# Altium project RoBeast_Control_Board.PrjPcb (part 4 of 4)

## Sheet RoBeast_uC.SchDoc: Microcontroller
size A; ApprovedBy: CR; DrawnBy: VM & IG; Revision: V1; SheetNumber: 7; SheetTotal: 9
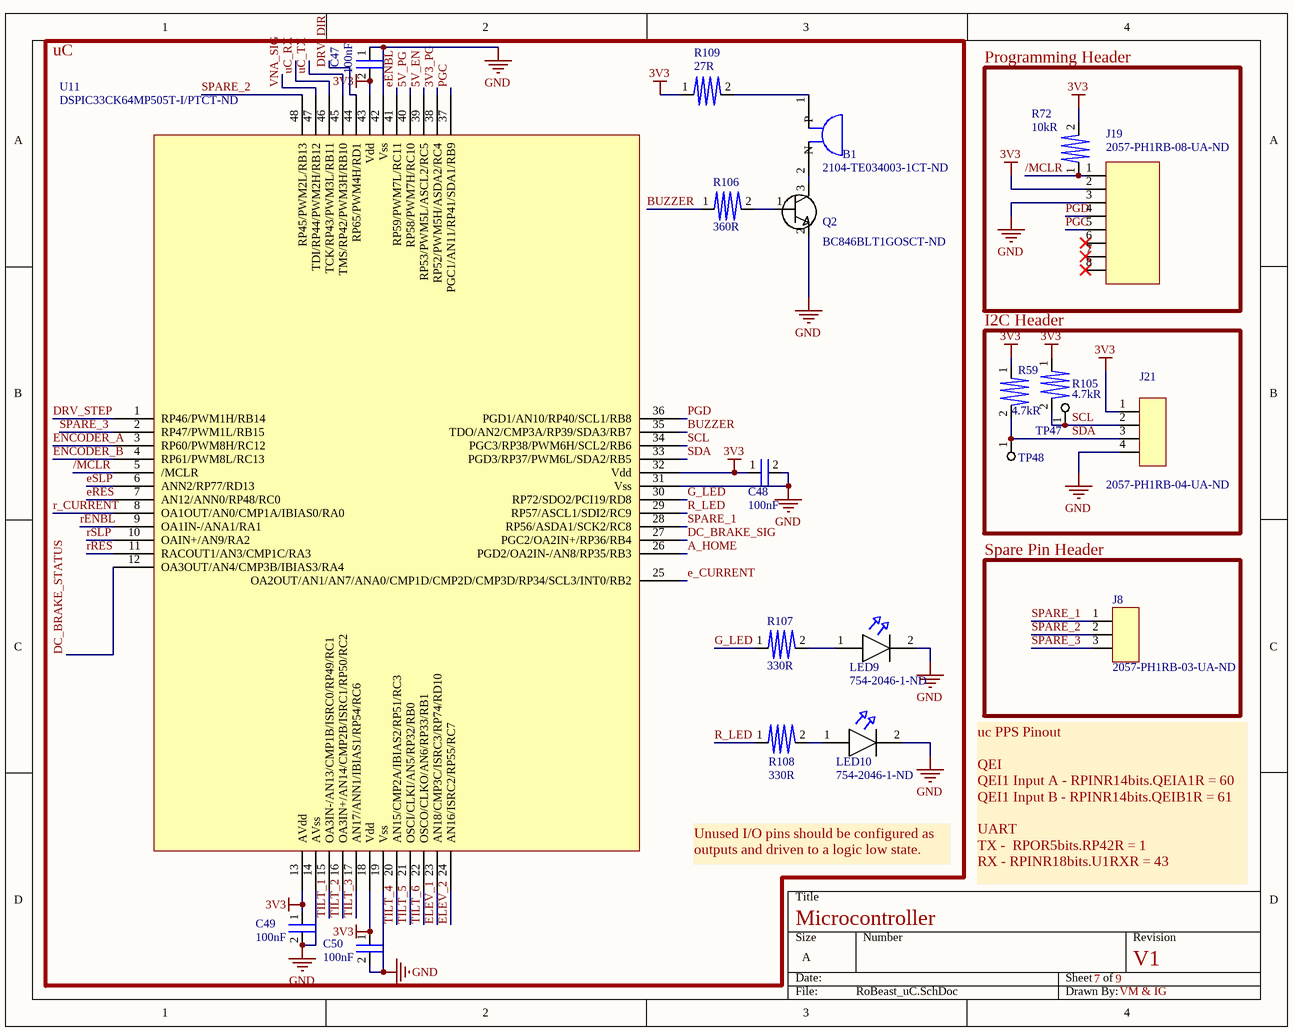
[diagram p6: RoBeast_uC.SchDoc]

### Parts
B1  Supplier Part Number 1: 2104-TE034003-1CT-ND  [TE034003-1]  (hidden comment: Buzzer)
C47  100nF  [0805]
C48  100nF  [0805]
C49  100nF  [0805]
C50  100nF  [0805]
J8  Supplier Part Number: 2057-PH1RB-03-UA-ND  [PH1RB-03-UA]  (hidden comment: 3 Pin Connector)
J19  Supplier Part Number 1: 2057-PH1RB-08-UA-ND  [PH1RB-08-UA]  (hidden comment: 8 Pin Connector)
J21  Supplier Part Number: 2057-PH1RB-04-UA-ND  [PH1RB-04-UA]  (hidden comment: 4 Pin Connector)
LED9  Supplier Part Number 1: 754-2046-1-ND  [0805_LED]  (hidden comment: Blue LED)
LED10  Supplier Part Number 1: 754-2046-1-ND  [0805_LED]  (hidden comment: Blue LED)
Q2  Supplier Part Number 1: BC846BLT1GOSCT-ND  [BC846BLT1G]  (hidden comment: NPN BJT)
R59  4.7kR  [0805]
R72  10kR  [0805]
R105  4.7kR  [0805]
R106  360R  [0805]
R107  330R  [0805]
R108  330R  [0805]
R109  27R  [0805]
TP47  Test Point  [RCWCTE]  (value not drawn)
TP48  Test Point  [RCWCTE]  (value not drawn)
U11  Supplier Part Number: DSPIC33CK64MP505T-I/PTCT-ND  [DSPIC33CK64MP505T-I/PT]  (hidden comment: uC)

### Blocks framed on the sheet
uC: B1 C47-C50 LED9 LED10 Q2 R106-R109 U11
Programming Header: J19 R72
I2C Header: J21 R59 R105 TP47 TP48
Spare Pin Header: J8

### Nets
3V3: C47.2 C48.1 C49.1 C50.1 J19.2 J21.1 R59.1 R72.2 R105.1 R109.1 U11.13(AVdd) U11.18(Vdd) U11.32(Vdd) U11.43(Vdd)
GND: C47.1 C48.2 C49.2 C50.2 J19.3 J21.4 LED9.2(K) LED10.2(K) Q2.2(E) U11.14(AVss) U11.19(Vss) U11.31(Vss) U11.42(Vss)
3V3_PG: U11.38(RP52/PWM5H/ASDA2/RC4)
5V_EN: U11.39(RP53/PWM5L/ASCL2/RC5)
5V_PG: U11.40(RP58/PWM7H/RC10)
/MCLR: J19.1 R72.1 U11.5(/MCLR)
A_HOME: U11.26(PGD2/OA2IN-/AN8/RP35/RB3)
BUZZER: R106.1 U11.35(TDO/AN2/CMP3A/RP39/SDA3/RB7)
DC_BRAKE_SIG: U11.27(PGC2/OA2IN+/RP36/RB4)
DC_BRAKE_STATUS: U11.12(OA3OUT/AN4/CMP3B/IBIAS3/RA4)
DRV_DIR: U11.44(RP65/PWM4H/RD1)
DRV_STEP: U11.1(RP46/PWM1H/RB14)
e_CURRENT: U11.25(OA2OUT/AN1/AN7/ANA0/CMP1D/CMP2D/CMP3D/RP34/SCL3/INT0/RB2)
eENBL: U11.41(RP59/PWM7L/RC11)
ELEV_1: U11.23(AN18/CMP3C/ISRC3/RP74/RD10)
ELEV_2: U11.24(AN16/ISRC2/RP55/RC7)
ENCODER_A: U11.3(RP60/PWM8H/RC12)
ENCODER_B: U11.4(RP61/PWM8L/RC13)
eRES: U11.7(AN12/ANN0/RP48/RC0)
eSLP: U11.6(ANN2/RP77/RD13)
G_LED: R107.1 U11.30(RP72/SDO2/PCI19/RD8)
PGC: J19.5 U11.37(PGC1/AN11/RP41/SDA1/RB9)
PGD: J19.4 U11.36(PGD1/AN10/RP40/SCL1/RB8)
r_CURRENT: U11.8(OA1OUT/AN0/CMP1A/IBIAS0/RA0)
R_LED: R108.1 U11.29(RP57/ASCL1/SDI2/RC9)
rENBL: U11.9(OA1IN-/ANA1/RA1)
rRES: U11.11(RACOUT1/AN3/CMP1C/RA3)
rSLP: U11.10(OAIN+/AN9/RA2)
SCL: J21.2 R105.2 TP47.1 U11.34(PGC3/RP38/PWM6H/SCL2/RB6)
SDA: J21.3 R59.2 TP48.1 U11.33(PGD3/RP37/PWM6L/SDA2/RB5)
SPARE_1: J8.1 U11.28(RP56/ASDA1/SCK2/RC8)
SPARE_2: J8.2 U11.48(RP45/PWM2L/RB13)
SPARE_3: J8.3 U11.2(RP47/PWM1L/RB15)
TILT_1: U11.15(OA3IN-/AN13/CMP1B/ISRC0/RP49/RC1)
TILT_2: U11.16(OA3IN+/AN14/CMP2B/ISRC1/RP50/RC2)
TILT_3: U11.17(AN17/ANN1/IBIAS1/RP54/RC6)
TILT_4: U11.20(AN15/CMP2A/IBIAS2/RP51/RC3)
TILT_5: U11.21(OSCI/CLKI/AN5/RP32/RB0)
TILT_6: U11.22(OSCO/CLKO/AN6/RP33/RB1)
uC_RX: U11.46(TCK/RP43/PWM3L/RB11)
uC_TX: U11.45(TMS/RP42/PWM3H/RB10)
VNA_SIG: U11.47(TDI/RP44/PWM2H/RB12)
NetB1_1: B1.1(P) R109.2
NetB1_2: B1.2(N) Q2.3(C)
NetLED9_1: LED9.1(A) R107.2
NetLED10_1: LED10.1(A) R108.2
NetQ2_1: Q2.1(B) R106.2

Not connected (* = marked no-connect by the designer): J19 6* 7* 8*

### Notes on the sheet
- Unused I/O pins should be configured as outputs and driven to a logic low state.
- uc PPS Pinout
  QEI
  QEI1 Input A - RPINR14bits.QEIA1R = 60
  QEI1 Input B - RPINR14bits.QEIB1R = 61
  UART
  TX -  RPOR5bits.RP42R = 1
  RX - RPINR18bits.U1RXR = 43

### Library data of the parts
B1 = TE034003-1: Electro-mechanical Transducer; Manufacturer: DB Unlimited; Supplier 1: Digikey; Manufacturer Part Number: TE034003-1; RoHS: No; Category: Audio Products; Stock 1: 5468; Pricing 1: 1=2.3, 10=1.911, 25=1.7652, 50=1.659, 100=1.5568, 250=1.44984, 500=1.33496, 1000=1.29987 (USD)
C47-C50 = C0805C104J5RAC7800: Ceramic Capacitor, Multilayer, Ceramic, 50V, 5% +Tol, 5% -Tol, X7R, 15% TC, 0.1uF, Surface Mount, 0805; Manufacturer: KEMET; Manufacturer Part Number: C0805C104J5RACTU; Multilayer: Yes; Supplier 1: Digikey; RoHS: Yes; Category: Ceramic Capacitors; Stock 1: 605061; Pricing 1: 1=0.18, 10=0.122, 50=0.0732, 100=0.0576, 500=0.04252, 1000=0.03519 (USD); Mount: Surface Mount; Number of Pins: 2; Dielectric Material: Ceramic; Package Shape: Rectangular; Size Code: 0805; Terminal Finish: Nickel; Min Operating Temperature: -55°C; Max Operating Temperature: 125°C; JESD-609 Code: e3; Capacitor Type: Ceramic; Negative Tolerance: 5%; Packaging: Tape and Reel; Positive Tolerance: 5%; Rated DC Voltage (URdc): 50V; Temperature Characteristics Code: X7R; Termination: Wraparound; Reach SVHC Compliant: Yes; RoHS Compliant: Yes; ComponentLink1URL: http://capacitoredge.kemet.com:80/capedge2/intellispec.jsp?pn=C0805C104J5RACTU&displayPN=C0805C104J5RACTU&src-supplier=IHS+Markit; ComponentLink1Description: http://capacitoredge.kemet.com:80/capedge2/intellispec.jsp?pn=C0805C104J5RACTU&displayPN=C0805C104J5RACTU&src-supplier=IHS+Markit; ComponentLink2URL: https://datasheet.ciiva.com/7842/1732721-7842179.pdf?src-supplier=Element14; ComponentLink2Description: https://datasheet.ciiva.com/7842/1732721-7842179.pdf?src-supplier=Element14; ComponentLink3URL: https://datasheet.ciiva.com/28682/1851736-28682223.pdf?src-supplier=Element14; ComponentLink3Description: https://datasheet.ciiva.com/28682/1851736-28682223.pdf?src-supplier=Element14; ComponentLink4URL: https://datasheet.ciiva.com/7258/1828800-7258413.pdf?src-supplier=Newark; ComponentLink4Description: https://datasheet.ciiva.com/7258/1828800-7258413.pdf?src-supplier=Newark; ComponentLink5URL: https://datasheet.ciiva.com/14589/70095383-14589015.pdf?src-supplier=Allied+Electronics; ComponentLink5Description: https://datasheet.ciiva.com/14589/70095383-14589015.pdf?src-supplier=Allied+Electronics; ComponentLink6URL: https://datasheet.ciiva.com/5417/kem-c1002-x7r-smd-5417352.pdf?src-supplier=Mouser; ComponentLink6Description: https://datasheet.ciiva.com/5417/kem-c1002-x7r-smd-5417352.pdf?src-supplier=Mouser; ComponentLink7URL: https://datasheet.ciiva.com/39122/docfinderpartnumberc0402c102k5ractu-39122924.pdf?src-supplier=Onlinecomponents.com; ComponentLink7Description: https://datasheet.ciiva.com/39122/docfinderpartnumberc0402c102k5ractu-39122924.pdf?src-supplier=Onlinecomponents.com; Supplier Part Number 1: 399-C0805C104J5RAC7800CT-ND; Capacitance: 100nF
J8 = PH1RB-03-UA: Conn Unshrouded Header HDR 3 POS 2.54mm Solder RA Side Entry Thru-Hole; Manufacturer: Adam Equipment; Supplier: Digikey; Manufacturer Part Number: PH1RB-03-UA; RoHS: No; Category: Connectors; Stock: 27919; Pricing: 1=0.12, 10=0.097, 100=0.0718, 500=0.05938, 1000=0.05196, 5000=0.04454, 10000=0.0433 (USD); ComponentLink1URL: http://www.adam-tech.com/downloader.php?p=PH1RB-XX-UA.pdf&src-supplier=Digikey; ComponentLink1Description: http://www.adam-tech.com/downloader.php?p=PH1RB-XX-UA.pdf&src-supplier=Digikey
J19 = PH1RB-08-UA: Conn Unshrouded Header HDR 8 POS 2.54mm Solder RA Thru-Hole; Manufacturer: Adam Equipment; Supplier 1: Digikey; Manufacturer Part Number: PH1RB-08-UA; RoHS: No; Category: Connectors; Stock 1: 10117; Pricing 1: 1=0.23, 10=0.196, 100=0.1505, 500=0.12738, 1000=0.10423, 5000=0.09265, 10000=0.08396 (USD)
J21 = PH1RB-04-UA: Conn Unshrouded Header HDR 4 POS 2.54mm Solder RA Thru-Hole; Manufacturer: Adam Equipment; Supplier: Digikey; Manufacturer Part Number: PH1RB-04-UA; RoHS: No; Category: Connectors; Stock: 13315; Pricing: 1=0.12, 10=0.094, 100=0.0697, 500=0.0577, 1000=0.05048, 5000=0.04327, 10000=0.04207 (USD); ComponentLink1URL: http://www.adam-tech.com/downloader.php?p=PH1RB-XX-UA.pdf&src-supplier=Digikey; ComponentLink1Description: http://www.adam-tech.com/downloader.php?p=PH1RB-XX-UA.pdf&src-supplier=Digikey
LED9 LED10 = APTD2012LQBC/D: Single Color LED; Manufacturer: Kingbright; Supplier 1: Digikey; Manufacturer Part Number: APTD2012LQBC/D; RoHS: Yes; Category: LEDs; Stock 1: 20866; Pricing 1: 1=0.54, 10=0.358, 100=0.2367, 1000=0.18275 (USD); RoHS Compliant: Yes; ComponentLink1URL: https://datasheet.ciiva.com:443/pdfs/VipMasterIC/IC/KBEC/KBEC-S-A0008946974/KBEC-S-A0008947044-1.pdf?src-supplier=IHS+Markit; ComponentLink1Description: https://datasheet.ciiva.com:443/pdfs/VipMasterIC/IC/KBEC/KBEC-S-A0008946974/KBEC-S-A0008947044-1.pdf?src-supplier=IHS+Markit; ComponentLink2URL: http://www.kingbrightusa.com/images/catalog/SPEC/APTD2012LQBC-D.pdf?src-supplier=Digikey; ComponentLink2Description: http://www.kingbrightusa.com/images/catalog/SPEC/APTD2012LQBC-D.pdf?src-supplier=Digikey
Q2 = BC846BLT1G: Small Signal Bipolar Transistor, 0.1A I(C), 65V V(BR)CEO, 1-Element, NPN, Silicon, TO-236; Manufacturer: ON Semiconductor; Package Body Material: Plastic; Power Dissipation-Max (Abs): 225mW; Max Collector Current: 100mA; DC Current Gain-Min (hFE): 200; Number of Elements: 1; Transition Frequency-Nom (fT): 100MHz; Transistor Application: SWITCHING; Time @ Peak Reflow Temperature-Max (s): 40s; Qualification Status: Not Qualified; Supplier 1: Digikey; Manufacturer Part Number: BC846BLT1G; RoHS: Yes; Category: BJTs; Stock 1: 1618453; Pricing 1: 1=0.14, 10=0.097, 100=0.0522, 500=0.04102, 1000=0.02848 (USD); Number of Pins: 3; Terminal Finish: Tin; Package Shape: Rectangular; Transistor Element Material: SILICON; Max Operating Temperature: 150°C; JESD-609 Code: e3; Polarity/Channel Type: NPN; Moisture Sensitivity Level: 1; Package Style: SMALL OUTLINEMeter; Surface Mount: Yes; Terminal Form: Gull Wing; Terminal Position: DUAL; Collector-emitter Voltage-Max: 65V; JESD-30 Code: R-PDSO-G3; Peak Reflow Temperature (Cel): 260°C; Reach SVHC Compliant: Yes; RoHS Compliant: Yes; JEDEC-95 Code: TO-236; ComponentLink1URL: https://datasheet.ciiva.com:443/pdfs/VipMasterIC/IC/ONSM/ONSM-S-A0009451914/ONSM-S-A0009451914-1.pdf?src-supplier=IHS+Markit; ComponentLink1Description: https://datasheet.ciiva.com:443/pdfs/VipMasterIC/IC/ONSM/ONSM-S-A0009451914/ONSM-S-A0009451914-1.pdf?src-supplier=IHS+Markit; ComponentLink2URL: https://datasheet.ciiva.com/15138/getdatasheetpartid-38790-15138644.pdf?src-supplier=Verical; ComponentLink2Description: https://datasheet.ciiva.com/15138/getdatasheetpartid-38790-15138644.pdf?src-supplier=Verical; ComponentLink3URL: https://datasheet.ciiva.com/27056/2010421-27056146.pdf?src-supplier=Jameco; ComponentLink3Description: https://datasheet.ciiva.com/27056/2010421-27056146.pdf?src-supplier=Jameco; ComponentLink4URL: https://datasheet.ciiva.com/7972/bc846alt1-d-7972189.pdf?src-supplier=Element14; ComponentLink4Description: https://datasheet.ciiva.com/7972/bc846alt1-d-7972189.pdf?src-supplier=Element14
R59 R105 = RCC08054K70FKEA: Fixed Resistor, Metal Glaze/thick Film, 0.25W, 4700ohm, 200V, 1% +/-Tol, 100ppm/Cel, Surface Mount, 0805; Manufacturer: Vishay Dale; Supplier 1: Digikey; Manufacturer Part Number: RCC08054K70FKEA; RoHS: Yes; Category: Chip SMD Resistors; Stock 1: 96612; Pricing 1: 1=0.15, 10=0.069, 50=0.0454, 100=0.0385, 500=0.0271, 1000=0.0236 (USD); Supplier Part Number 1: 541-RCC08054K70FKEACT-ND
R72 = RMCF0805FT10K0: Fixed Resistor, Metal Glaze/thick Film, 0.125W, 10000ohm, 150V, 1% +/-Tol, 100ppm/Cel, Surface Mount, 0805; Manufacturer: Stackpole Electronics; Rated Power Dissipation (P): 125mW; Rated Temperature: 70°C; Temperature Coefficient: 100ppm/°C; Package Height: 0.5mm; Package Length: 2mm; Package Width: 1.25mm; Reference Standard: AEC-Q200; Supplier 1: Digikey; Manufacturer Part Number: RMCF0805FT10K0; RoHS: Yes; Category: Chip SMD Resistors; Stock 1: 3602197; Pricing 1: 1=0.1, 10=0.02, 50=0.0124, 100=0.0103, 500=0.007, 1000=0.00601 (USD); Mount: Surface Mount; Number of Pins: 2; Package Shape: Rectangular; Size Code: 0805; Terminal Finish: Nickel; Min Operating Temperature: -55°C; Max Operating Temperature: 155°C; Tolerance: 1%; JESD-609 Code: e3; Resistor Type: FIXED RESISTOR; Construction: Rectangular; Package Style: SMTMeter; Packaging: Tape and Reel; Resistance: 10kR; Technology: METAL GLAZE/THICK FILM; Termination: Wraparound; Working Voltage: 150V; Reach SVHC Compliant: Yes; RoHS Compliant: Yes; ComponentLink1URL: https://datasheet.ciiva.com:443/pdfs/VipMasterIC/IC/SEIE/SEIE-S-A0009541969/SEIE-S-A0009541969-1.pdf?src-supplier=IHS+Markit; ComponentLink1Description: https://datasheet.ciiva.com:443/pdfs/VipMasterIC/IC/SEIE/SEIE-S-A0009541969/SEIE-S-A0009541969-1.pdf?src-supplier=IHS+Markit; ComponentLink2URL: https://datasheet.ciiva.com/15193/getdatasheetpartid-362046-15193525.pdf?src-supplier=Verical; ComponentLink2Description: https://datasheet.ciiva.com/15193/getdatasheetpartid-362046-15193525.pdf?src-supplier=Verical; Supplier Part Number 1: RMCF0805FT10K0CT-ND
R106 = RC0805FR-07360RL: Fixed Resistor, Metal Glaze/thick Film, 0.125W, 360ohm, 150V, 1% +/-Tol, 100ppm/Cel, Surface Mount, 0805; Manufacturer: Yageo; Additional Feature: LASER TRIMMABLE; Rated Power Dissipation (P): 125mW; Rated Temperature: 70°C; Temperature Coefficient: 100ppm/°C; Package Height: 0.5mm; Package Length: 2mm; Package Width: 1.25mm; Supplier 1: Digikey; Manufacturer Part Number: RC0805FR-07360RL; RoHS: Yes; Category: Chip SMD Resistors; Stock 1: 62488; Pricing 1: 1=0.1, 10=0.026, 50=0.0162, 100=0.0136, 500=0.00938, 1000=0.0081 (USD); Mount: Surface Mount; Number of Pins: 2; Package Shape: Rectangular; Size Code: 0805; Terminal Finish: Nickel; Min Operating Temperature: -55°C; Max Operating Temperature: 155°C; Tolerance: 1%; JESD-609 Code: e3; Resistor Type: FIXED RESISTOR; Construction: Chip; Package Style: SMTMeter; Packaging: Tape and Reel; Resistance: 360R; Technology: METAL GLAZE/THICK FILM; Termination: Wraparound; Working Voltage: 150V; Reach SVHC Compliant: Yes; RoHS Compliant: Yes; ComponentLink1URL: https://datasheet.ciiva.com:443/pdfs/VipMasterIC/IC/YAGO/YAGO-S-A0008145938/YAGO-S-A0008145938-1.pdf?src-supplier=IHS+Markit; ComponentLink1Description: https://datasheet.ciiva.com:443/pdfs/VipMasterIC/IC/YAGO/YAGO-S-A0008145938/YAGO-S-A0008145938-1.pdf?src-supplier=IHS+Markit; ComponentLink2URL: https://datasheet.ciiva.com/11808/0900766b8106beab-11808261.pdf?src-supplier=Rs; ComponentLink2Description: https://datasheet.ciiva.com/11808/0900766b8106beab-11808261.pdf?src-supplier=Rs; ComponentLink3URL: https://datasheet.ciiva.com/17423/rc0805-17423149.pdf?src-supplier=Future+Electronics; ComponentLink3Description: https://datasheet.ciiva.com/17423/rc0805-17423149.pdf?src-supplier=Future+Electronics; ComponentLink4URL: https://datasheet.ciiva.com/12667/rc0805-12667401.pdf?src-supplier=Mouser; ComponentLink4Description: https://datasheet.ciiva.com/12667/rc0805-12667401.pdf?src-supplier=Mouser; Supplier Part Number 1: 311-360CRCT-ND
R107 R108 = RC0805FR-13330RL: Fixed Resistor, Metal Glaze/thick Film, 0.125W, 330ohm, 150V, 1% +/-Tol, 100ppm/Cel, Surface Mount, 0805; Manufacturer: Yageo; Additional Feature: LASER TRIMMABLE; Rated Power Dissipation (P): 125mW; Rated Temperature: 70°C; Temperature Coefficient: 100ppm/°C; Package Height: 0.5mm; Package Length: 2mm; Package Width: 1.25mm; Supplier 1: Digikey; Manufacturer Part Number: RC0805FR-13330RL; RoHS: Yes; Category: Chip SMD Resistors; Stock 1: 36292; Pricing 1: 1=0.1, 10=0.025, 50=0.016, 100=0.0133, 500=0.00912, 1000=0.00787, 5000=0.00577, 10000=0.00511 (USD); Mount: Surface Mount; Number of Pins: 2; Package Shape: Rectangular; Size Code: 0805; Terminal Finish: Nickel; Min Operating Temperature: -55°C; Max Operating Temperature: 155°C; Tolerance: 1%; JESD-609 Code: e3; Resistor Type: FIXED RESISTOR; Construction: Chip; Package Style: SMTMeter; Packaging: Tape and Reel; Resistance: 330R; Technology: METAL GLAZE/THICK FILM; Termination: Wraparound; Working Voltage: 150V; Reach SVHC Compliant: Yes; RoHS Compliant: Yes; ComponentLink1URL: https://datasheet.ciiva.com:443/pdfs/VipMasterIC/IC/YAGO/YAGO-S-A0008145938/YAGO-S-A0008145938-1.pdf?src-supplier=IHS+Markit; ComponentLink1Description: https://datasheet.ciiva.com:443/pdfs/VipMasterIC/IC/YAGO/YAGO-S-A0008145938/YAGO-S-A0008145938-1.pdf?src-supplier=IHS+Markit; ComponentLink2URL: https://datasheet.ciiva.com/12575/rc0805-257173-12575525.pdf?src-supplier=Mouser; ComponentLink2Description: https://datasheet.ciiva.com/12575/rc0805-257173-12575525.pdf?src-supplier=Mouser; Supplier Part Number 1: 13-RC0805FR-13330RLCT-ND
R109 = SG73P2ATTD27R0F: Fixed Resistor, Metal Glaze/thick Film, 0.5W, 27ohm, 400V, 1% +/-Tol, 200ppm/Cel, Surface Mount, 0805; Manufacturer: KOA Speer; Rated Power Dissipation (P): 250mW; Rated Temperature: 70°C; Temperature Coefficient: 200ppm/°C; Package Height: 0.5mm; Package Length: 2mm; Package Width: 1.25mm; Reference Standard: AEC-Q200; Supplier 1: Digikey; Manufacturer Part Number: SG73P2ATTD27R0F; RoHS: Yes; Category: Chip SMD Resistors; Stock 1: 9351; Pricing 1: 1=0.18, 10=0.09, 50=0.0602, 100=0.0514, 500=0.03686, 1000=0.03245 (USD); Mount: Surface Mount; Number of Pins: 2; Size Code: 0805; Terminal Finish: Nickel; Min Operating Temperature: -55°C; Max Operating Temperature: 155°C; Tolerance: 1%; JESD-609 Code: e3; Resistor Type: FIXED RESISTOR; Construction: Rectangular; Package Style: SMTMeter; Packaging: Tape and Reel; Resistance: 27R; Technology: METAL GLAZE/THICK FILM; Termination: Wraparound; Working Voltage: 400V; Reach SVHC Compliant: Yes; RoHS Compliant: Yes; ComponentLink1URL: https://datasheet.ciiva.com:443/pdfs/VipMasterIC/IC/KOAS/KOAS-S-A0009586268/KOAS-S-A0009586268-1.pdf?src-supplier=IHS+Markit; ComponentLink1Description: https://datasheet.ciiva.com:443/pdfs/VipMasterIC/IC/KOAS/KOAS-S-A0009586268/KOAS-S-A0009586268-1.pdf?src-supplier=IHS+Markit; ComponentLink2URL: http://www.koaspeer.com/catimages/Products/SG73/SG73.pdf?src-supplier=Mouser; ComponentLink2Description: http://www.koaspeer.com/catimages/Products/SG73/SG73.pdf?src-supplier=Mouser; Supplier Part Number 1: 2019-SG73P2ATTD27R0FCT-ND
TP47 TP48 = RCWCTE: Testing/Accessories; Manufacturer: KOA Speer; Rated Temperature: 70°C; Resistance: 0R; Package Height: 2mm; Package Length: 3.2mm; Package Width: 1.6mm; Reference Standard: AEC-Q200; Supplier 1: Digikey; Manufacturer Part Number: RCWCTE; RoHS: Yes; Category: Chip SMD Resistors; Stock 1: 132357; Pricing 1: 1=0.16, 10=0.137, 25=0.1212, 50=0.1132, 100=0.105, 250=0.09292, 500=0.08888, 1000=0.07272 (USD); Mount: Surface Mount; Number of Pins: 2; Package Shape: Rectangular; Size Code: 1206; Terminal Finish: Copper; Min Operating Temperature: -55°C; Max Operating Temperature: 125°C; JESD-609 Code: e2; Resistor Type: FIXED RESISTOR; Construction: Chip; Package Style: SMTMeter; Packaging: Tape and Reel; Termination: Wraparound; Reach SVHC Compliant: Yes; RoHS Compliant: Yes; ComponentLink1URL: https://datasheet.ciiva.com:443/pdfs/VipMasterIC/IC/KOAS/KOASS03065/KOASS03065-1.pdf?src-supplier=IHS+Markit; ComponentLink1Description: https://datasheet.ciiva.com:443/pdfs/VipMasterIC/IC/KOAS/KOASS03065/KOASS03065-1.pdf?src-supplier=IHS+Markit; ComponentLink2URL: https://datasheet.ciiva.com/34302/1876186-34302940.pdf?src-supplier=Jameco; ComponentLink2Description: https://datasheet.ciiva.com/34302/1876186-34302940.pdf?src-supplier=Jameco; ComponentLink3URL: https://datasheet.ciiva.com/5556/rc-5556236.pdf?src-supplier=Mouser; ComponentLink3Description: https://datasheet.ciiva.com/5556/rc-5556236.pdf?src-supplier=Mouser; ComponentLink4URL: https://datasheet.ciiva.com/26821/getdatasheetpartid-110197-26821157.pdf?src-supplier=Verical; ComponentLink4Description: https://datasheet.ciiva.com/26821/getdatasheetpartid-110197-26821157.pdf?src-supplier=Verical; Supplier Part Number 1: 2019-RCWCTECT-ND
U11 = DSPIC33CK64MP505T-I/PT: 16-Bit Size, 0-Ext Bit, 64MHz, CMOS, PQFP48; Manufacturer: Microchip; Supplier: Digikey; Manufacturer Part Number: DSPIC33CK64MP505T-I/PT; RoHS: No; Category: Microcontrollers; Stock: 1600; Pricing: 1=3.75, 25=3.44, 100=3.12 (USD); ComponentLink1URL: https://datasheet.ciiva.com:443/pdfs/VipMasterIC/IC/MCHP/MCHP-S-A0007771634/MCHP-S-A0007771634-1.pdf?src-supplier=IHS+Markit; ComponentLink1Description: https://datasheet.ciiva.com:443/pdfs/VipMasterIC/IC/MCHP/MCHP-S-A0007771634/MCHP-S-A0007771634-1.pdf?src-supplier=IHS+Markit; ComponentLink2URL: http://www.microchip.com/mymicrochip/filehandler.aspx?ddocname=en606233&src-supplier=Digikey; ComponentLink2Description: http://www.microchip.com/mymicrochip/filehandler.aspx?ddocname=en606233&src-supplier=Digikey

## Sheet RoBeast_Current_Sense.SchDoc: Current Sense
size A4; ApprovedBy: CR; DrawnBy: VM & IG; Revision: V1; SheetNumber: 8; SheetTotal: 9
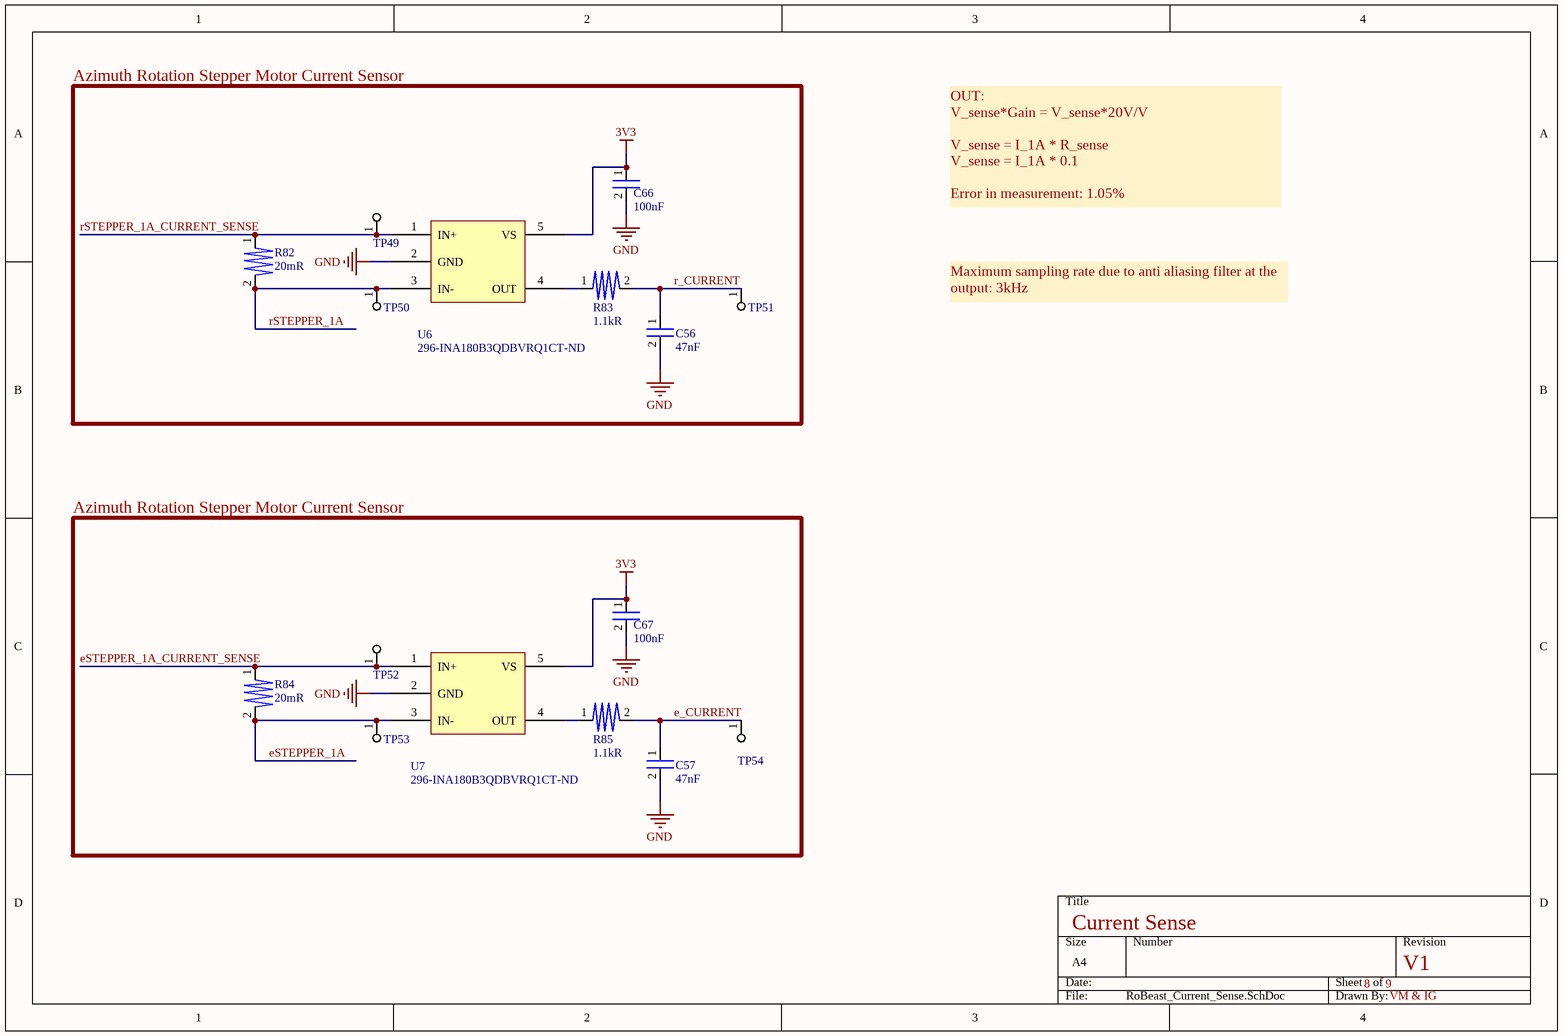
[diagram p7: RoBeast_Current_Sense.SchDoc]

### Parts
C56  47nF  [0805]
C57  47nF  [0805]
C66  100nF  [0805]
C67  100nF  [0805]
R82  20mR  [0805]
R83  1.1kR  [0805]
R84  20mR  [0805]
R85  1.1kR  [0805]
TP49  Test Point  [RCWCTE]  (value not drawn)
TP50  Test Point  [RCWCTE]  (value not drawn)
TP51  Test Point  [RCWCTE]  (value not drawn)
TP52  Test Point  [RCWCTE]  (value not drawn)
TP53  Test Point  [RCWCTE]  (value not drawn)
TP54  Test Point  [RCWCTE]  (value not drawn)
U6  Supplier Part Number 1: 296-INA180B3QDBVRQ1CT-ND  [INA180B3QDBVRQ1]  (hidden comment: Current Sensor, Gain 100V/V)
U7  Supplier Part Number 1: 296-INA180B3QDBVRQ1CT-ND  [INA180B3QDBVRQ1]  (hidden comment: Current Sensor, Gain 100V/V)

### Blocks framed on the sheet
Azimuth Rotation Stepper Motor Current Sensor: C56 C66 R82 R83 TP49-TP51 U6
Azimuth Rotation Stepper Motor Current Sensor: C57 C67 R84 R85 TP52-TP54 U7

### Nets
3V3: C66.1 C67.1 U6.5(VS) U7.5(VS)
GND: C56.2 C57.2 C66.2 C67.2 U6.2(GND) U7.2(GND)
e_CURRENT: C57.1 R85.2 TP54.1
eSTEPPER_1A: R84.2 TP53.1 U7.3(IN-)
eSTEPPER_1A_CURRENT_SENSE: R84.1 TP52.1 U7.1(IN+)
r_CURRENT: C56.1 R83.2 TP51.1
rSTEPPER_1A: R82.2 TP50.1 U6.3(IN-)
rSTEPPER_1A_CURRENT_SENSE: R82.1 TP49.1 U6.1(IN+)
NetR83_1: R83.1 U6.4(OUT)
NetR85_1: R85.1 U7.4(OUT)

### Notes on the sheet
- OUT:
  V_sense*Gain = V_sense*20V/V
  V_sense = I_1A * R_sense
  V_sense = I_1A * 0.1
  Error in measurement: 1.05%
- Maximum sampling rate due to anti aliasing filter at the output: 3kHz

### Library data of the parts
C56 C57 = CL21B473KBCNNNC: Ceramic Capacitor, Multilayer, Ceramic, 50V, 10% +Tol, 10% -Tol, X7R, 15% TC, 0.047uF, Surface Mount, 0805; Manufacturer: Samsung; Multilayer: Yes; Supplier 1: Digikey; Manufacturer Part Number: CL21B473KBCNNNC; RoHS: Yes; Category: Ceramic Capacitors; Stock 1: 502166; Pricing 1: 1=0.1, 10=0.036, 50=0.0208, 100=0.0161, 500=0.01212, 1000=0.00953 (USD); Mount: Surface Mount; Number of Pins: 2; Dielectric Material: Ceramic; Package Shape: Rectangular; Size Code: 0805; Terminal Finish: Nickel; Min Operating Temperature: -55°C; Max Operating Temperature: 125°C; JESD-609 Code: e3; Capacitance: 47nF; Capacitor Type: Ceramic; Negative Tolerance: 10%; Package Style: SMTMeter; Packaging: Tape and Reel; Positive Tolerance: 10%; Rated DC Voltage (URdc): 50V; Temperature Characteristics Code: X7R; Termination: Wraparound; Length: 2mm; Width: 1.25mm; Height: 0.85mm; Reach SVHC Compliant: Yes; RoHS Compliant: Yes; ComponentLink1URL: https://datasheet.ciiva.com:443/pdfs/VipMasterIC/IC/SEMS/SEMS-S-A0008523078/SEMS-S-A0008523078-1.pdf?src-supplier=IHS+Markit; ComponentLink1Description: https://datasheet.ciiva.com:443/pdfs/VipMasterIC/IC/SEMS/SEMS-S-A0008523078/SEMS-S-A0008523078-1.pdf?src-supplier=IHS+Markit; ComponentLink2URL: https://datasheet.ciiva.com/15195/getdatasheetpartid-357428-15195917.pdf?src-supplier=Verical; ComponentLink2Description: https://datasheet.ciiva.com/15195/getdatasheetpartid-357428-15195917.pdf?src-supplier=Verical; ComponentLink3URL: https://datasheet.ciiva.com/29199/454396-da-01-en-vs-kondensator-0805-29199678.pdf?src-supplier=Conrad; ComponentLink3Description: https://datasheet.ciiva.com/29199/454396-da-01-en-vs-kondensator-0805-29199678.pdf?src-supplier=Conrad; ComponentLink4URL: https://datasheet.ciiva.com/16289/cl05b104kq5nnnc-16289529.pdf?src-supplier=Future+Electronics; ComponentLink4Description: https://datasheet.ciiva.com/16289/cl05b104kq5nnnc-16289529.pdf?src-supplier=Future+Electronics; Supplier Part Number 1: 1276-1250-1-ND
C66 C67 = C0805C104J5RAC7800: as C47 on sheet RoBeast_uC; Supplier 1: Digikey; RoHS: Yes; Category: Ceramic Capacitors; Stock 1: 605061; Pricing 1: 1=0.18, 10=0.122, 50=0.0732, 100=0.0576, 500=0.04252, 1000=0.03519 (USD); Mount: Surface Mount; Number of Pins: 2; Dielectric Material: Ceramic; Package Shape: Rectangular; Size Code: 0805; Terminal Finish: Nickel; Min Operating Temperature: -55°C; Max Operating Temperature: 125°C; JESD-609 Code: e3; Capacitor Type: Ceramic; Negative Tolerance: 5%; Packaging: Tape and Reel; Positive Tolerance: 5%; Rated DC Voltage (URdc): 50V; Temperature Characteristics Code: X7R; Termination: Wraparound; Reach SVHC Compliant: Yes; RoHS Compliant: Yes; ComponentLink1URL: http://capacitoredge.kemet.com:80/capedge2/intellispec.jsp?pn=C0805C104J5RACTU&displayPN=C0805C104J5RACTU&src-supplier=IHS+Markit; ComponentLink1Description: http://capacitoredge.kemet.com:80/capedge2/intellispec.jsp?pn=C0805C104J5RACTU&displayPN=C0805C104J5RACTU&src-supplier=IHS+Markit; ComponentLink2URL: https://datasheet.ciiva.com/7842/1732721-7842179.pdf?src-supplier=Element14; ComponentLink2Description: https://datasheet.ciiva.com/7842/1732721-7842179.pdf?src-supplier=Element14; ComponentLink3URL: https://datasheet.ciiva.com/28682/1851736-28682223.pdf?src-supplier=Element14; ComponentLink3Description: https://datasheet.ciiva.com/28682/1851736-28682223.pdf?src-supplier=Element14; ComponentLink4URL: https://datasheet.ciiva.com/7258/1828800-7258413.pdf?src-supplier=Newark; ComponentLink4Description: https://datasheet.ciiva.com/7258/1828800-7258413.pdf?src-supplier=Newark; ComponentLink5URL: https://datasheet.ciiva.com/14589/70095383-14589015.pdf?src-supplier=Allied+Electronics; ComponentLink5Description: https://datasheet.ciiva.com/14589/70095383-14589015.pdf?src-supplier=Allied+Electronics; ComponentLink6URL: https://datasheet.ciiva.com/5417/kem-c1002-x7r-smd-5417352.pdf?src-supplier=Mouser; ComponentLink6Description: https://datasheet.ciiva.com/5417/kem-c1002-x7r-smd-5417352.pdf?src-supplier=Mouser; ComponentLink7URL: https://datasheet.ciiva.com/39122/docfinderpartnumberc0402c102k5ractu-39122924.pdf?src-supplier=Onlinecomponents.com; ComponentLink7Description: https://datasheet.ciiva.com/39122/docfinderpartnumberc0402c102k5ractu-39122924.pdf?src-supplier=Onlinecomponents.com; Supplier Part Number 1: 399-C0805C104J5RAC7800CT-ND; Capacitance: 100nF
R82 R84 = ERJ-6CWDR020V: Resistor Thick Film 0.02Ohm 0.5% 0.5W 2-Pin 0805 T/R; Manufacturer: Panasonic; Supplier 1: Digikey; Manufacturer Part Number: ERJ-6CWDR020V; RoHS: No; Category: Chip SMD Resistors; Stock 1: 1997; Pricing 1: 1=0.61, 10=0.427, 25=0.3652, 50=0.3176, 100=0.2488, 250=0.22764, 500=0.1853, 1000=0.14697 (USD); ComponentLink1URL: https://datasheet.octopart.com/ERJ-6CWDR020V-Panasonic-datasheet-68299093.pdf?src-supplier=Future+Electronics; ComponentLink1Description: https://datasheet.octopart.com/ERJ-6CWDR020V-Panasonic-datasheet-68299093.pdf?src-supplier=Future+Electronics; ComponentLink2URL: http://industrial.panasonic.com/cdbs/www-data/pdf/RDN0000/AOA0000C313.pdf?src-supplier=Newark; ComponentLink2Description: http://industrial.panasonic.com/cdbs/www-data/pdf/RDN0000/AOA0000C313.pdf?src-supplier=Newark; ComponentLink3URL: http://industrial.panasonic.com/cdbs/www-data/pdf/RDN0000/AOA0000C313.pdf?src-supplier=Farnell; ComponentLink3Description: http://industrial.panasonic.com/cdbs/www-data/pdf/RDN0000/AOA0000C313.pdf?src-supplier=Farnell; ComponentLink4URL: https://industrial.panasonic.com/cdbs/www-data/pdf/RDN0000/AOA0000C313.pdf?src-supplier=Digikey; ComponentLink4Description: https://industrial.panasonic.com/cdbs/www-data/pdf/RDN0000/AOA0000C313.pdf?src-supplier=Digikey; Supplier Part Number 1: P124408CT-ND
R83 R85 = RCS08051K10FKEA: Fixed Resistor, Metal Glaze/thick Film, 0.4W, 1100ohm, 150V, 1% +/-Tol, 100ppm/Cel, Surface Mount, 0805; Manufacturer: Vishay Dale; Supplier 1: Digikey; Manufacturer Part Number: RCS08051K10FKEA; RoHS: Yes; Category: Chip SMD Resistors; Stock 1: 9985; Pricing 1: 1=0.2, 10=0.104, 50=0.0712, 100=0.0613, 500=0.045, 1000=0.03986 (USD); ComponentLink1URL: https://datasheet.ciiva.com:443/pdfs/VipMasterIC/IC/VISH/VISH-S-A0007978036/VISH-S-A0007978036-1.pdf?src-supplier=IHS+Markit; ComponentLink1Description: https://datasheet.ciiva.com:443/pdfs/VipMasterIC/IC/VISH/VISH-S-A0007978036/VISH-S-A0007978036-1.pdf?src-supplier=IHS+Markit; ComponentLink2URL: http://www.vishay.com/docs/20065/rcse3.pdf?src-supplier=Digikey; ComponentLink2Description: http://www.vishay.com/docs/20065/rcse3.pdf?src-supplier=Digikey; Supplier Part Number 1: 541-RCS08051K10FKEACT-ND
TP49-TP54 = RCWCTE: as TP47 on sheet RoBeast_uC; Supplier 1: Digikey; Manufacturer Part Number: RCWCTE; RoHS: Yes; Category: Chip SMD Resistors; Stock 1: 132357; Pricing 1: 1=0.16, 10=0.137, 25=0.1212, 50=0.1132, 100=0.105, 250=0.09292, 500=0.08888, 1000=0.07272 (USD); Mount: Surface Mount; Number of Pins: 2; Package Shape: Rectangular; Size Code: 1206; Terminal Finish: Copper; Min Operating Temperature: -55°C; Max Operating Temperature: 125°C; JESD-609 Code: e2; Resistor Type: FIXED RESISTOR; Construction: Chip; Package Style: SMTMeter; Packaging: Tape and Reel; Termination: Wraparound; Reach SVHC Compliant: Yes; RoHS Compliant: Yes; ComponentLink1URL: https://datasheet.ciiva.com:443/pdfs/VipMasterIC/IC/KOAS/KOASS03065/KOASS03065-1.pdf?src-supplier=IHS+Markit; ComponentLink1Description: https://datasheet.ciiva.com:443/pdfs/VipMasterIC/IC/KOAS/KOASS03065/KOASS03065-1.pdf?src-supplier=IHS+Markit; ComponentLink2URL: https://datasheet.ciiva.com/34302/1876186-34302940.pdf?src-supplier=Jameco; ComponentLink2Description: https://datasheet.ciiva.com/34302/1876186-34302940.pdf?src-supplier=Jameco; ComponentLink3URL: https://datasheet.ciiva.com/5556/rc-5556236.pdf?src-supplier=Mouser; ComponentLink3Description: https://datasheet.ciiva.com/5556/rc-5556236.pdf?src-supplier=Mouser; ComponentLink4URL: https://datasheet.ciiva.com/26821/getdatasheetpartid-110197-26821157.pdf?src-supplier=Verical; ComponentLink4Description: https://datasheet.ciiva.com/26821/getdatasheetpartid-110197-26821157.pdf?src-supplier=Verical; Supplier Part Number 1: 2019-RCWCTECT-ND
U6 U7 = INA180B3QDBVRQ1: Operational Amplifier, 1 Func, 500uV Offset-Max, PDSO5; Manufacturer: Texas Instruments; Supplier 1: Digikey; Manufacturer Part Number: INA180B3QDBVRQ1; RoHS: Yes; Category: Amplifiers - Op Amps, Buffer, Instrumentation; Stock 1: 5909; Pricing 1: 1=0.58, 10=0.492, 25=0.4596, 100=0.3676, 250=0.34136, 500=0.28886, 1000=0.22321 (USD)

## Sheet RoBeast_DC_Brake.SchDoc: DC Brake
size A4; ApprovedBy: CR; DrawnBy: VM & IG; Revision: V1; SheetNumber: 9; SheetTotal: 9
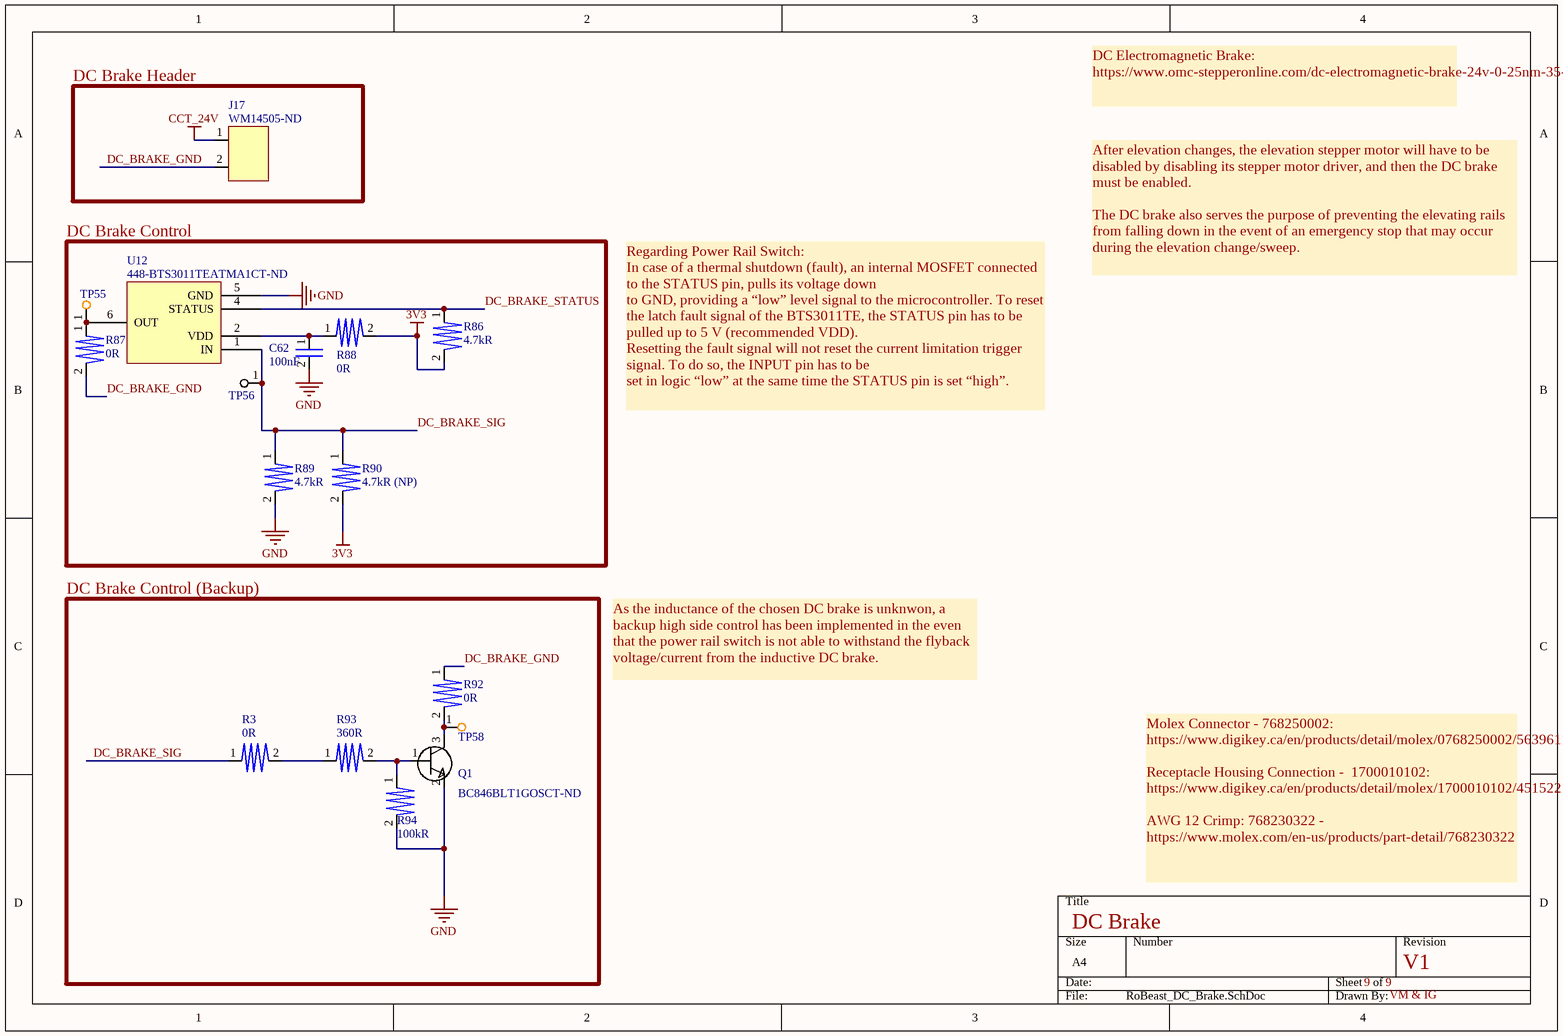
[diagram p8: RoBeast_DC_Brake.SchDoc]

### Parts
C62  100nF  [0805]
J17  2 Pin Connector  [WM14505-ND]  (value not drawn)
Q1  Supplier Part Number 1: BC846BLT1GOSCT-ND  [BC846BLT1G]  (hidden comment: NPN BJT)
R3  0R  [0805]
R86  4.7kR  [0805]
R87  0R  [0805]
R88  0R  [0805]
R89  4.7kR  [0805]
R90  4.7kR (NP)  [0805]
R92  0R  [0805]
R93  360R  [0805]
R94  100kR  [0805]
TP55  Test Point  [Test Point]  (value not drawn)
TP56  Test Point  [RCWCTE]  (value not drawn)
TP58  Test Point  [Test Point]  (value not drawn)
U12  Supplier Part Number 1: 448-BTS3011TEATMA1CT-ND  [BTS3011TEATMA1]  (hidden comment: Power Rail Switch)

### Blocks framed on the sheet
DC Brake Header: J17
DC Brake Control: C62 R86-R90 TP55 TP56 U12
DC Brake Control (Backup): Q1 R3 R92-R94 TP58

### Nets
3V3: R86.2 R88.2 R90.2
CCT_24V: J17.1
GND: C62.2 Q1.2(E) R89.2 R94.2 U12.5(GND)
DC_BRAKE_GND: J17.2 R87.2 R92.1
DC_BRAKE_SIG: R3.1 R89.1 R90.1 TP56.1 U12.1(IN)
DC_BRAKE_STATUS: R86.1 U12.4(STATUS)
NetC62_1: C62.1 R88.1 U12.2(VDD)
NetQ1_1: Q1.1(B) R93.2 R94.1
NetQ1_3: Q1.3(C) R92.2 TP58.1
NetR3_2: R3.2 R93.1
NetR87_1: R87.1 TP55.1 U12.6(OUT)

### Notes on the sheet
- DC Electromagnetic Brake: https://www.omc-stepperonline.com/dc-electromagnetic-brake-24v-0-25nm-35-4oz-in-for-nema-17-stepper-motor-swb-01
- After elevation changes, the elevation stepper motor will have to be disabled by disabling its stepper motor driver, and then the DC brake must be enabled.
  The DC brake also serves the purpose of preventing the elevating rails from falling down in the event of an emergency stop that may occur during the elevation change/sweep.
- Regarding Power Rail Switch:
  In case of a thermal shutdown (fault), an internal MOSFET connected to the STATUS pin, pulls its voltage down
  to GND, providing a “low” level signal to the microcontroller. To reset the latch fault signal of the BTS3011TE, the STATUS pin has to be pulled up to 5 V (recommended VDD).
  Resetting the fault signal will not reset the current limitation trigger signal. To do so, the INPUT pin has to be
  set in logic “low” at the same time the STATUS pin is set “high”.
- As the inductance of the chosen DC brake is unknwon, a backup high side control has been implemented in the even that the power rail switch is not able to withstand the flyback voltage/current from the inductive DC brake.
- Molex Connector - 768250002: https://www.digikey.ca/en/products/detail/molex/0768250002/5639611
  Receptacle Housing Connection -  1700010102: https://www.digikey.ca/en/products/detail/molex/1700010102/4515221
  AWG 12 Crimp: 768230322 - https://www.molex.com/en-us/products/part-detail/768230322

### Library data of the parts
C62 = C0805C104J5RAC7800: as C47 on sheet RoBeast_uC; Supplier 1: Digikey; RoHS: Yes; Category: Ceramic Capacitors; Stock 1: 605061; Pricing 1: 1=0.18, 10=0.122, 50=0.0732, 100=0.0576, 500=0.04252, 1000=0.03519 (USD); Mount: Surface Mount; Number of Pins: 2; Dielectric Material: Ceramic; Package Shape: Rectangular; Size Code: 0805; Terminal Finish: Nickel; Min Operating Temperature: -55°C; Max Operating Temperature: 125°C; JESD-609 Code: e3; Capacitor Type: Ceramic; Negative Tolerance: 5%; Packaging: Tape and Reel; Positive Tolerance: 5%; Rated DC Voltage (URdc): 50V; Temperature Characteristics Code: X7R; Termination: Wraparound; Reach SVHC Compliant: Yes; RoHS Compliant: Yes; ComponentLink1URL: http://capacitoredge.kemet.com:80/capedge2/intellispec.jsp?pn=C0805C104J5RACTU&displayPN=C0805C104J5RACTU&src-supplier=IHS+Markit; ComponentLink1Description: http://capacitoredge.kemet.com:80/capedge2/intellispec.jsp?pn=C0805C104J5RACTU&displayPN=C0805C104J5RACTU&src-supplier=IHS+Markit; ComponentLink2URL: https://datasheet.ciiva.com/7842/1732721-7842179.pdf?src-supplier=Element14; ComponentLink2Description: https://datasheet.ciiva.com/7842/1732721-7842179.pdf?src-supplier=Element14; ComponentLink3URL: https://datasheet.ciiva.com/28682/1851736-28682223.pdf?src-supplier=Element14; ComponentLink3Description: https://datasheet.ciiva.com/28682/1851736-28682223.pdf?src-supplier=Element14; ComponentLink4URL: https://datasheet.ciiva.com/7258/1828800-7258413.pdf?src-supplier=Newark; ComponentLink4Description: https://datasheet.ciiva.com/7258/1828800-7258413.pdf?src-supplier=Newark; ComponentLink5URL: https://datasheet.ciiva.com/14589/70095383-14589015.pdf?src-supplier=Allied+Electronics; ComponentLink5Description: https://datasheet.ciiva.com/14589/70095383-14589015.pdf?src-supplier=Allied+Electronics; ComponentLink6URL: https://datasheet.ciiva.com/5417/kem-c1002-x7r-smd-5417352.pdf?src-supplier=Mouser; ComponentLink6Description: https://datasheet.ciiva.com/5417/kem-c1002-x7r-smd-5417352.pdf?src-supplier=Mouser; ComponentLink7URL: https://datasheet.ciiva.com/39122/docfinderpartnumberc0402c102k5ractu-39122924.pdf?src-supplier=Onlinecomponents.com; ComponentLink7Description: https://datasheet.ciiva.com/39122/docfinderpartnumberc0402c102k5ractu-39122924.pdf?src-supplier=Onlinecomponents.com; Supplier Part Number 1: 399-C0805C104J5RAC7800CT-ND; Capacitance: 100nF
J17 = WM14505-ND: Board Connector, 2 Contact(s), 2 Row(s), Male, Right Angle, Solder Terminal; Manufacturer: Molex; Manufacturer Part Number: 0026013114; Mixed Contacts: No; Number of Contacts: 2; Option: General Purpose; Mating Information: MULTIPLE MATING PARTS AVAILABLE; Supplier: Mouser; RoHS: Yes; Stock: 22788; Pricing: 1=1.12, 10=0.793, 50=0.793, 100=0.704, 1000=0.635, 10000=0.528 (USD); Mounting Technology: Board; Contact Material: Brass; Contact Finish - Mating: GOLD; Contact Finish - Termination: Matte Tin (Sn); Connector Type: BOARD CONNECTOR; JESD-609 Code: e3; Contact Gender: Male; Mounting Style: RIGHT ANGLE; Termination: Solder; Filter Feature: No; Number of Rows Loaded: 2; Flammability Rating: UL94 V-2; Reach SVHC Compliant: Yes; RoHS Compliant: Yes; DIN Conformance: No; IEC Conformance: No; MIL Conformance: No; ComponentLink1URL: https://datasheet.ciiva.com:443/pdfs/VipMasterIC/IC/MOLE/MOLE-S-A0006764423/MOLE-S-A0006865681-1.pdf?src-supplier=IHS+Markit; ComponentLink1Description: https://datasheet.ciiva.com:443/pdfs/VipMasterIC/IC/MOLE/MOLE-S-A0006764423/MOLE-S-A0006865681-1.pdf?src-supplier=IHS+Markit; Supplier 1: Digikey; Supplier Part Number: 538-26-01-3114; Supplier Part Number 1: WM14505-ND
Q1 = BC846BLT1G: as Q2 on sheet RoBeast_uC; Supplier 1: Digikey; Manufacturer Part Number: BC846BLT1G; RoHS: Yes; Category: BJTs; Stock 1: 1618453; Pricing 1: 1=0.14, 10=0.097, 100=0.0522, 500=0.04102, 1000=0.02848 (USD); Number of Pins: 3; Terminal Finish: Tin; Package Shape: Rectangular; Transistor Element Material: SILICON; Max Operating Temperature: 150°C; JESD-609 Code: e3; Polarity/Channel Type: NPN; Moisture Sensitivity Level: 1; Package Style: SMALL OUTLINEMeter; Surface Mount: Yes; Terminal Form: Gull Wing; Terminal Position: DUAL; Collector-emitter Voltage-Max: 65V; JESD-30 Code: R-PDSO-G3; Peak Reflow Temperature (Cel): 260°C; Reach SVHC Compliant: Yes; RoHS Compliant: Yes; JEDEC-95 Code: TO-236; ComponentLink1URL: https://datasheet.ciiva.com:443/pdfs/VipMasterIC/IC/ONSM/ONSM-S-A0009451914/ONSM-S-A0009451914-1.pdf?src-supplier=IHS+Markit; ComponentLink1Description: https://datasheet.ciiva.com:443/pdfs/VipMasterIC/IC/ONSM/ONSM-S-A0009451914/ONSM-S-A0009451914-1.pdf?src-supplier=IHS+Markit; ComponentLink2URL: https://datasheet.ciiva.com/15138/getdatasheetpartid-38790-15138644.pdf?src-supplier=Verical; ComponentLink2Description: https://datasheet.ciiva.com/15138/getdatasheetpartid-38790-15138644.pdf?src-supplier=Verical; ComponentLink3URL: https://datasheet.ciiva.com/27056/2010421-27056146.pdf?src-supplier=Jameco; ComponentLink3Description: https://datasheet.ciiva.com/27056/2010421-27056146.pdf?src-supplier=Jameco; ComponentLink4URL: https://datasheet.ciiva.com/7972/bc846alt1-d-7972189.pdf?src-supplier=Element14; ComponentLink4Description: https://datasheet.ciiva.com/7972/bc846alt1-d-7972189.pdf?src-supplier=Element14
R3 R87 R88 R92 = RMCF0805ZT0R00: Fixed Resistor, Metal Glaze/thick Film, 0.125W, 0ohm, Surface Mount, 0805; Manufacturer: Stackpole Electronics; Rated Power Dissipation (P): 125mW; Rated Temperature: 70°C; Working Voltage: 150V; Package Height: 0.5mm; Package Length: 2mm; Package Width: 1.25mm; Reference Standard: AEC-Q200; Supplier 1: Digikey; Manufacturer Part Number: RMCF0805ZT0R00; RoHS: Yes; Category: Chip SMD Resistors; Stock 1: 1154169; Pricing 1: 1=0.1, 10=0.017, 25=0.0128, 50=0.0096, 100=0.0068, 250=0.00544, 500=0.00436, 1000=0.00321 (USD); Mount: Surface Mount; Number of Pins: 2; Package Shape: Rectangular; Size Code: 0805; Terminal Finish: Nickel; Min Operating Temperature: -55°C; Max Operating Temperature: 155°C; JESD-609 Code: e3; Resistor Type: FIXED RESISTOR; Construction: Rectangular; Package Style: SMTMeter; Packaging: Tape and Reel; Resistance: 0R; Technology: METAL GLAZE/THICK FILM; Termination: Wraparound; Reach SVHC Compliant: Yes; RoHS Compliant: Yes; ComponentLink1URL: https://datasheet.ciiva.com:443/pdfs/VipMasterIC/IC/SEIE/SEIE-S-A0007077258/SEIE-S-A0007077258-1.pdf?src-supplier=IHS+Markit; ComponentLink1Description: https://datasheet.ciiva.com:443/pdfs/VipMasterIC/IC/SEIE/SEIE-S-A0007077258/SEIE-S-A0007077258-1.pdf?src-supplier=IHS+Markit; ComponentLink2URL: https://datasheet.ciiva.com/15193/getdatasheetpartid-360417-15193658.pdf?src-supplier=Verical; ComponentLink2Description: https://datasheet.ciiva.com/15193/getdatasheetpartid-360417-15193658.pdf?src-supplier=Verical; Supplier Part Number 1: RMCF0805ZT0R00CT-ND
R86 R89 R90 = RCC08054K70FKEA: as R59 on sheet RoBeast_uC; Supplier 1: Digikey; Manufacturer Part Number: RCC08054K70FKEA; RoHS: Yes; Category: Chip SMD Resistors; Stock 1: 96612; Pricing 1: 1=0.15, 10=0.069, 50=0.0454, 100=0.0385, 500=0.0271, 1000=0.0236 (USD); Supplier Part Number 1: 541-RCC08054K70FKEACT-ND
R93 = RC0805FR-07360RL: as R106 on sheet RoBeast_uC; Supplier 1: Digikey; Manufacturer Part Number: RC0805FR-07360RL; RoHS: Yes; Category: Chip SMD Resistors; Stock 1: 62488; Pricing 1: 1=0.1, 10=0.026, 50=0.0162, 100=0.0136, 500=0.00938, 1000=0.0081 (USD); Mount: Surface Mount; Number of Pins: 2; Package Shape: Rectangular; Size Code: 0805; Terminal Finish: Nickel; Min Operating Temperature: -55°C; Max Operating Temperature: 155°C; Tolerance: 1%; JESD-609 Code: e3; Resistor Type: FIXED RESISTOR; Construction: Chip; Package Style: SMTMeter; Packaging: Tape and Reel; Resistance: 360R; Technology: METAL GLAZE/THICK FILM; Termination: Wraparound; Working Voltage: 150V; Reach SVHC Compliant: Yes; RoHS Compliant: Yes; ComponentLink1URL: https://datasheet.ciiva.com:443/pdfs/VipMasterIC/IC/YAGO/YAGO-S-A0008145938/YAGO-S-A0008145938-1.pdf?src-supplier=IHS+Markit; ComponentLink1Description: https://datasheet.ciiva.com:443/pdfs/VipMasterIC/IC/YAGO/YAGO-S-A0008145938/YAGO-S-A0008145938-1.pdf?src-supplier=IHS+Markit; ComponentLink2URL: https://datasheet.ciiva.com/11808/0900766b8106beab-11808261.pdf?src-supplier=Rs; ComponentLink2Description: https://datasheet.ciiva.com/11808/0900766b8106beab-11808261.pdf?src-supplier=Rs; ComponentLink3URL: https://datasheet.ciiva.com/17423/rc0805-17423149.pdf?src-supplier=Future+Electronics; ComponentLink3Description: https://datasheet.ciiva.com/17423/rc0805-17423149.pdf?src-supplier=Future+Electronics; ComponentLink4URL: https://datasheet.ciiva.com/12667/rc0805-12667401.pdf?src-supplier=Mouser; ComponentLink4Description: https://datasheet.ciiva.com/12667/rc0805-12667401.pdf?src-supplier=Mouser; Supplier Part Number 1: 311-360CRCT-ND
R94 = CRCW0805100KFKEAHP: Fixed Resistor, Metal Glaze/thick Film, 0.5W, 100000ohm, 150V, 1% +/-Tol, 100ppm/Cel, Surface Mount, 0805; Manufacturer: Vishay; Manufacturer Series: CRCW-HPE3; Rated Power Dissipation (P): 500mW; Rated Temperature: 70°C; Temperature Coefficient: 100ppm/°C; Package Height: 0.5mm; Package Length: 2mm; Package Width: 1.25mm; Reference Standard: AEC-Q200; Supplier 1: Digikey; Manufacturer Part Number: CRCW0805100KFKEAHP; RoHS: Yes; Category: Chip SMD Resistors; Stock 1: 104274; Pricing 1: 1=0.2, 10=0.103, 50=0.0688, 100=0.0587, 500=0.0421, 1000=0.03706 (USD); Mount: Surface Mount; Number of Pins: 2; Package Shape: Rectangular; Terminal Finish: Nickel; Size Code: 0805; Min Operating Temperature: -55°C; Max Operating Temperature: 155°C; Tolerance: 1%; JESD-609 Code: e3; Package Style: SMTMeter; Technology: METAL GLAZE/THICK FILM; Resistor Type: FIXED RESISTOR; Construction: Chip; Packaging: Tape and Reel; Resistance: 100kR; Series: CRCW-HP E3; Termination: Wraparound; Working Voltage: 150V; Reach SVHC Compliant: Yes; RoHS Compliant: Yes; ComponentLink1URL: https://datasheet.ciiva.com:443/pdfs/VipMasterIC/IC/VISH/VISH-S-A0009391795/VISH-S-A0009391795-1.pdf?src-supplier=IHS+Markit; ComponentLink1Description: https://datasheet.ciiva.com:443/pdfs/VipMasterIC/IC/VISH/VISH-S-A0009391795/VISH-S-A0009391795-1.pdf?src-supplier=IHS+Markit; ComponentLink2URL: https://datasheet.ciiva.com/2475/crcwhpe3-2475664.pdf?src-supplier=Digikey; ComponentLink2Description: https://datasheet.ciiva.com/2475/crcwhpe3-2475664.pdf?src-supplier=Digikey; ComponentLink3URL: https://datasheet.ciiva.com/8982/crcwhpe3-8982333.pdf?src-supplier=Avnet; ComponentLink3Description: https://datasheet.ciiva.com/8982/crcwhpe3-8982333.pdf?src-supplier=Avnet; ComponentLink4URL: https://datasheet.ciiva.com/7777/424479-7777350.pdf?src-supplier=Element14; ComponentLink4Description: https://datasheet.ciiva.com/7777/424479-7777350.pdf?src-supplier=Element14; ComponentLink5URL: https://datasheet.ciiva.com/7777/424479-7777351.pdf?src-supplier=Element14; ComponentLink5Description: https://datasheet.ciiva.com/7777/424479-7777351.pdf?src-supplier=Element14; Supplier Part Number 1: 541-100KTCT-ND
TP56 = RCWCTE: as TP47 on sheet RoBeast_uC; Supplier 1: Digikey; Manufacturer Part Number: RCWCTE; RoHS: Yes; Category: Chip SMD Resistors; Stock 1: 132357; Pricing 1: 1=0.16, 10=0.137, 25=0.1212, 50=0.1132, 100=0.105, 250=0.09292, 500=0.08888, 1000=0.07272 (USD); Mount: Surface Mount; Number of Pins: 2; Package Shape: Rectangular; Size Code: 1206; Terminal Finish: Copper; Min Operating Temperature: -55°C; Max Operating Temperature: 125°C; JESD-609 Code: e2; Resistor Type: FIXED RESISTOR; Construction: Chip; Package Style: SMTMeter; Packaging: Tape and Reel; Termination: Wraparound; Reach SVHC Compliant: Yes; RoHS Compliant: Yes; ComponentLink1URL: https://datasheet.ciiva.com:443/pdfs/VipMasterIC/IC/KOAS/KOASS03065/KOASS03065-1.pdf?src-supplier=IHS+Markit; ComponentLink1Description: https://datasheet.ciiva.com:443/pdfs/VipMasterIC/IC/KOAS/KOASS03065/KOASS03065-1.pdf?src-supplier=IHS+Markit; ComponentLink2URL: https://datasheet.ciiva.com/34302/1876186-34302940.pdf?src-supplier=Jameco; ComponentLink2Description: https://datasheet.ciiva.com/34302/1876186-34302940.pdf?src-supplier=Jameco; ComponentLink3URL: https://datasheet.ciiva.com/5556/rc-5556236.pdf?src-supplier=Mouser; ComponentLink3Description: https://datasheet.ciiva.com/5556/rc-5556236.pdf?src-supplier=Mouser; ComponentLink4URL: https://datasheet.ciiva.com/26821/getdatasheetpartid-110197-26821157.pdf?src-supplier=Verical; ComponentLink4Description: https://datasheet.ciiva.com/26821/getdatasheetpartid-110197-26821157.pdf?src-supplier=Verical; Supplier Part Number 1: 2019-RCWCTECT-ND
U12 = BTS3011TEATMA1: Current Limit SW 1-IN 1-OUT 3V to 5.5V 10A Automotive 7-Pin(6+Tab) D2PAK T/R; Manufacturer: Infineon; Supplier 1: Digikey; Manufacturer Part Number: BTS3011TEATMA1; RoHS: Yes; Category: Power Management ICs; Stock 1: 16298; Pricing 1: 1=2.62, 10=2.353, 25=2.2196, 100=1.891, 250=1.7756, 500=1.55364, 1000=1.2873 (USD); Reach SVHC Compliant: No; ComponentLink1URL: https://datasheet.ciiva.com:443/pdfs/VipMasterIC/IC/INFN/INFN-S-A0006623395/INFN-S-A0006623395-1.pdf?src-supplier=IHS+Markit; ComponentLink1Description: https://datasheet.ciiva.com:443/pdfs/VipMasterIC/IC/INFN/INFN-S-A0006623395/INFN-S-A0006623395-1.pdf?src-supplier=IHS+Markit

## Nets that join several sheets
3V3: RoBeast_UI (R4.1 R81.2), RoBeast_Power_Switching (5 pins), RoBeast_Driver (18 pins), RoBeast_Positional_Feedback (10 pins), RoBeast_Power_Linear (R66.2 TP28.1), RoBeast_uC (14 pins), RoBeast_Current_Sense (C66.1 C67.1 U6.5 U7.5), RoBeast_DC_Brake (R86.2 R88.2 R90.2)
5V: RoBeast_UI (R23.1 R58.1), RoBeast_Power_Switching (J23.2 R20.1 TP35.1), RoBeast_Positional_Feedback (J16.1), RoBeast_Power_Linear (R67.2)
AC/DC IN: RoBeast_UI (R5.1), RoBeast_Power_Switching (5 pins)
CCT_24V: RoBeast_Power_Switching (7 pins), RoBeast_Driver (10 pins), RoBeast_Power_Linear (R78.1 R80.1), RoBeast_DC_Brake (J17.1)
GND: RoBeast_Mounting_Shield (84 pins), RoBeast_UI (25 pins), RoBeast_Power_Switching (33 pins), RoBeast_Driver (42 pins), RoBeast_Positional_Feedback (19 pins), RoBeast_Power_Linear (10 pins), RoBeast_uC (13 pins), RoBeast_Current_Sense (6 pins), RoBeast_DC_Brake (5 pins)
3V3_PG: RoBeast_Power_Switching (R16.1 U1.8), RoBeast_uC (U11.38)
5V_EN: RoBeast_Power_Switching (R19.1 TP60.1 U2.10), RoBeast_uC (U11.39)
5V_PG: RoBeast_Power_Switching (R73.1 U2.8), RoBeast_uC (U11.40)
A_HOME: RoBeast_Positional_Feedback (C31.1 J7.9 R52.1 TP20.1), RoBeast_uC (U11.26)
DC_BRAKE_SIG: RoBeast_UI (R57.1), RoBeast_uC (U11.27), RoBeast_DC_Brake (5 pins)
DC_BRAKE_STATUS: RoBeast_uC (U11.12), RoBeast_DC_Brake (R86.1 U12.4)
DRV_DIR: RoBeast_Driver (U5.19 U8.19), RoBeast_uC (U11.44)
DRV_STEP: RoBeast_Driver (U5.16 U8.16), RoBeast_uC (U11.1)
e_CURRENT: RoBeast_uC (U11.25), RoBeast_Current_Sense (C57.1 R85.2 TP54.1)
eENBL: RoBeast_Driver (R44.1 R45.2 TP42.1 U8.2), RoBeast_uC (U11.41)
ELEV_1: RoBeast_Positional_Feedback (C30.1 J7.7 R51.1 TP16.1), RoBeast_uC (U11.23)
ELEV_2: RoBeast_Positional_Feedback (C38.1 J7.8 R63.1 TP24.1), RoBeast_uC (U11.24)
ENCODER_A: RoBeast_Positional_Feedback (J18.3), RoBeast_uC (U11.3)
ENCODER_B: RoBeast_Positional_Feedback (J18.5), RoBeast_uC (U11.4)
eRES: RoBeast_Driver (R103.1 R104.1 TP62.1 U8.12), RoBeast_uC (U11.7)
eSLP: RoBeast_UI (R9.1), RoBeast_Driver (R64.1 R65.1 TP43.1 U8.14), RoBeast_uC (U11.6)
eSTEPPER_1A: RoBeast_Driver (R98.1), RoBeast_Current_Sense (R84.2 TP53.1 U7.3)
eSTEPPER_1A_CURRENT_SENSE: RoBeast_Driver (U8.24), RoBeast_Current_Sense (R84.1 TP52.1 U7.1)
r_CURRENT: RoBeast_uC (U11.8), RoBeast_Current_Sense (C56.1 R83.2 TP51.1)
rENBL: RoBeast_Driver (R29.1 R30.2 TP37.1 U5.2), RoBeast_uC (U11.9)
rRES: RoBeast_Driver (R91.1 R102.1 TP57.1 U5.12), RoBeast_uC (U11.11)
rSLP: RoBeast_UI (R7.1), RoBeast_Driver (R32.1 R33.1 TP38.1 U5.14), RoBeast_uC (U11.10)
rSTEPPER_1A: RoBeast_Driver (R27.1), RoBeast_Current_Sense (R82.2 TP50.1 U6.3)
rSTEPPER_1A_CURRENT_SENSE: RoBeast_Driver (U5.24), RoBeast_Current_Sense (R82.1 TP49.1 U6.1)
SW_IN_FILTER: RoBeast_Power_Switching (9 pins), RoBeast_Power_Linear (R71.1 R79.1)
TILT_1: RoBeast_Positional_Feedback (C32.1 J7.1 R53.1 TP17.1), RoBeast_uC (U11.15)
TILT_2: RoBeast_Positional_Feedback (C33.1 J7.2 R54.1 TP18.1), RoBeast_uC (U11.16)
TILT_3: RoBeast_Positional_Feedback (C34.1 J7.3 R55.1 TP19.1), RoBeast_uC (U11.17)
TILT_4: RoBeast_Positional_Feedback (C35.1 J7.4 R60.1 TP21.1), RoBeast_uC (U11.20)
TILT_5: RoBeast_Positional_Feedback (C36.1 J7.5 R61.1 TP22.1), RoBeast_uC (U11.21)
TILT_6: RoBeast_Positional_Feedback (C37.1 J7.6 R62.1 TP23.1), RoBeast_uC (U11.22)
uC_RX: RoBeast_UI (J2.4 TP3.1 TP25.1 U4.1), RoBeast_uC (U11.46)
uC_TX: RoBeast_UI (J2.5 TP4.1 TP26.1 U4.4), RoBeast_uC (U11.45)
VNA_SIG: RoBeast_UI (R2.1), RoBeast_uC (U11.47)